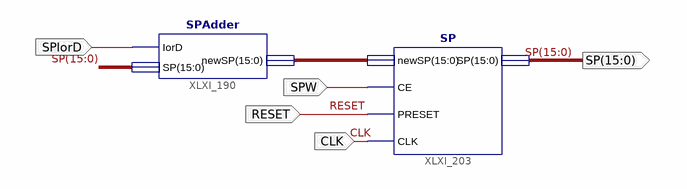
[diagram p0: schematic sheet 1]
// Xilinx ISE schematic IntegratedTestSP.sch (spartan3e) as structural Verilog: 2 symbols, 5 ports
module IntegratedTestSP (
  input  SPW,
  input  SPIorD,
  input  CLK,
  input  RESET,
  output [15:0] SP
);

  wire [15:0] XLXN_43;

  SPAdder XLXI_190 (.IorD(SPIorD), .SP(SP), .newSP(XLXN_43));
  SP XLXI_203 (.SP(SP), .CE(SPW), .PRESET(RESET), .CLK(CLK), .newSP(XLXN_43));
endmodule
